# EAGLE design control (EAGLE 6.6.0)
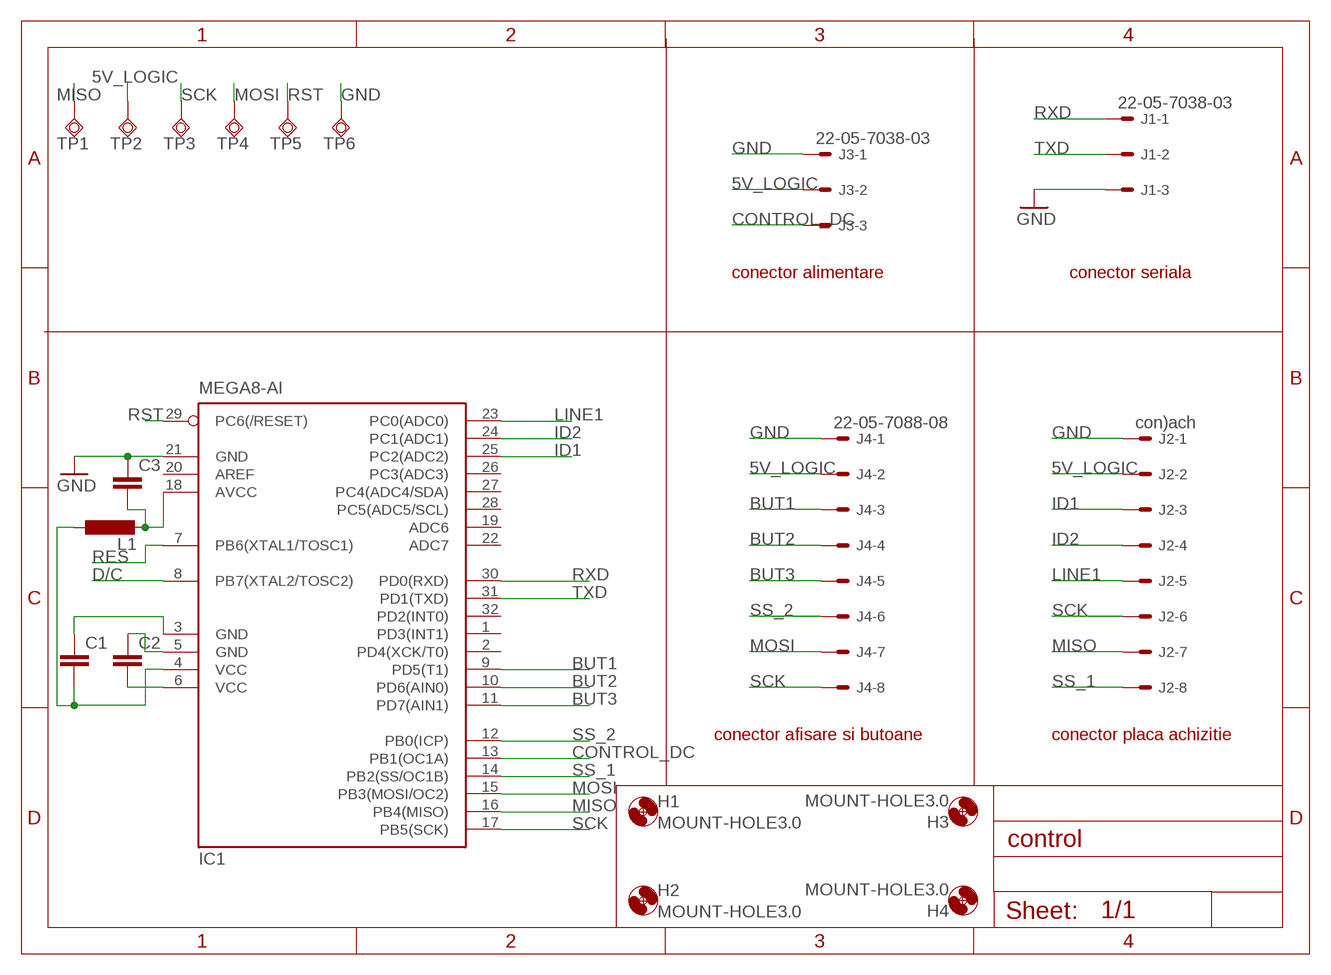
[diagram p0: schematic, sheet 1]

## Parts
C1  C-EUC0805K  [C0805K]
C2  C-EUC0805K  [C0805K]
C3  C-EUC0805K  [C0805K]
H1  MOUNT-HOLE3.0  [3,0]
H2  MOUNT-HOLE3.0  [3,0]
H3  MOUNT-HOLE3.0  [3,0]
H4  MOUNT-HOLE3.0  [3,0]
IC1  MEGA8-AI  [TQFP32-08]
J1  22-05-7038-03  [7395-03]
J2  con)ach  22-05-7088-08  [7395-08]
J3  22-05-7038-03  [7395-03]
J4  22-05-7088-08  [7395-08]
L1  L-EU0204/7  [0204/7]
TP1  TPSQPAD1-13  [P1-13]
TP2  TPSQPAD1-13  [P1-13]
TP3  TPSQPAD1-13  [P1-13]
TP4  TPSQPAD1-13  [P1-13]
TP5  TPSQPAD1-13  [P1-13]
TP6  TPSQPAD1-13  [P1-13]

## Nets
5V_LOGIC: C1.2 C2.2 IC1.4(VCC) IC1.6(VCC) J2.2 J3.2 J4.2 L1.1 TP2.TP
BUT1: IC1.9(PD5(T1)) J4.3
BUT2: IC1.10(PD6(AIN0)) J4.4
BUT3: IC1.11(PD7(AIN1)) J4.5
CONTROL_DC: IC1.13(PB1(OC1A)) J3.3
D/C: IC1.8(PB7(XTAL2/TOSC2))
GND: C1.1 C2.1 C3.1 IC1.3(GND) IC1.5(GND) IC1.21(GND) J1.3 J2.1 J3.1 J4.1 TP6.TP
ID1: IC1.25(PC2(ADC2)) J2.3
ID2: IC1.24(PC1(ADC1)) J2.4
LINE1: IC1.23(PC0(ADC0)) J2.5
MISO: IC1.16(PB4(MISO)) J2.7 TP1.TP
MOSI: IC1.15(PB3(MOSI/OC2)) J4.7 TP4.TP
N$1: C3.2 IC1.18(AVCC) L1.2
RES: IC1.7(PB6(XTAL1/TOSC1))
RST: IC1.29(PC6(/RESET)) TP5.TP
RXD: IC1.30(PD0(RXD)) J1.1
SCK: IC1.17(PB5(SCK)) J2.6 J4.8 TP3.TP
SS_1: IC1.14(PB2(SS/OC1B)) J2.8
SS_2: IC1.12(PB0(ICP)) J4.6
TXD: IC1.31(PD1(TXD)) J1.2
Unconnected: IC1.1(PD3(INT1)) IC1.2(PD4(XCK/T0)) IC1.19(ADC6) IC1.20(AREF) IC1.22(ADC7) IC1.26(PC3(ADC3)) IC1.27(PC4(ADC4/SDA)) IC1.28(PC5(ADC5/SCL)) IC1.32(PD2(INT0))

## Notes on the sheet
- conector alimentare | conector seriala
- conector afisare si butoane | conector placa achizitie

## Library data of the parts
C1-C3 = resistor:C-EU: CAPACITOR, European symbol
H1-H4 = holes:MOUNT-HOLE: MOUNTING HOLE with drill center marker
IC1 = atmel:MEGA8: MICROCONTROLLER 8 Kbytes FLASH, 1 kbytes SRAM, 512 bytes EEPROM, USART, 6-channel 10 bit ADC, 2-channel 8 bit ADC Pin compatible with Atmega48, ATMega88, ATMega168 Source: avr.lbr; MPN: ATMEGA8-16AU; OC_FARNELL: 9171371; OC_NEWARK: 73M8863
J1 J3 = con-molex:22-?-03: CONNECTOR wire to board 2.54 mm (.1 inch) pitch header; OC_FARNELL: unknown; OC_NEWARK: unknown
J2 J4 = con-molex:22-?-08: CONNECTOR wire to board 2.54 mm (.1 inch) pitch header; OC_FARNELL: unknown; OC_NEWARK: unknown
L1 = resistor:L-EU: INDUCTOR, European symbol
TP1-TP6 = testpad:TPSQ: Test pad

## Board
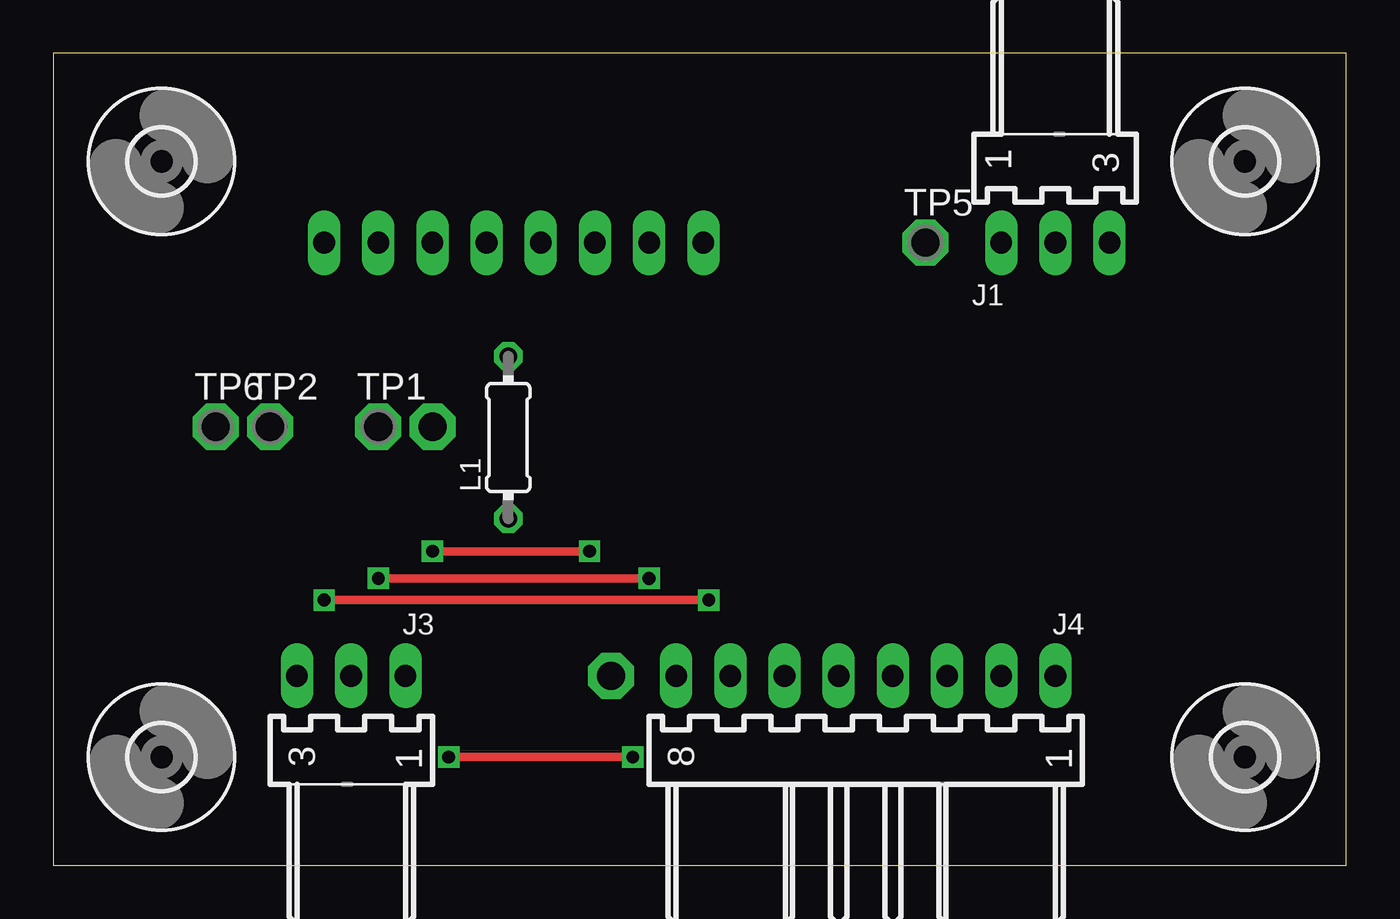
[diagram p1: board, top side]
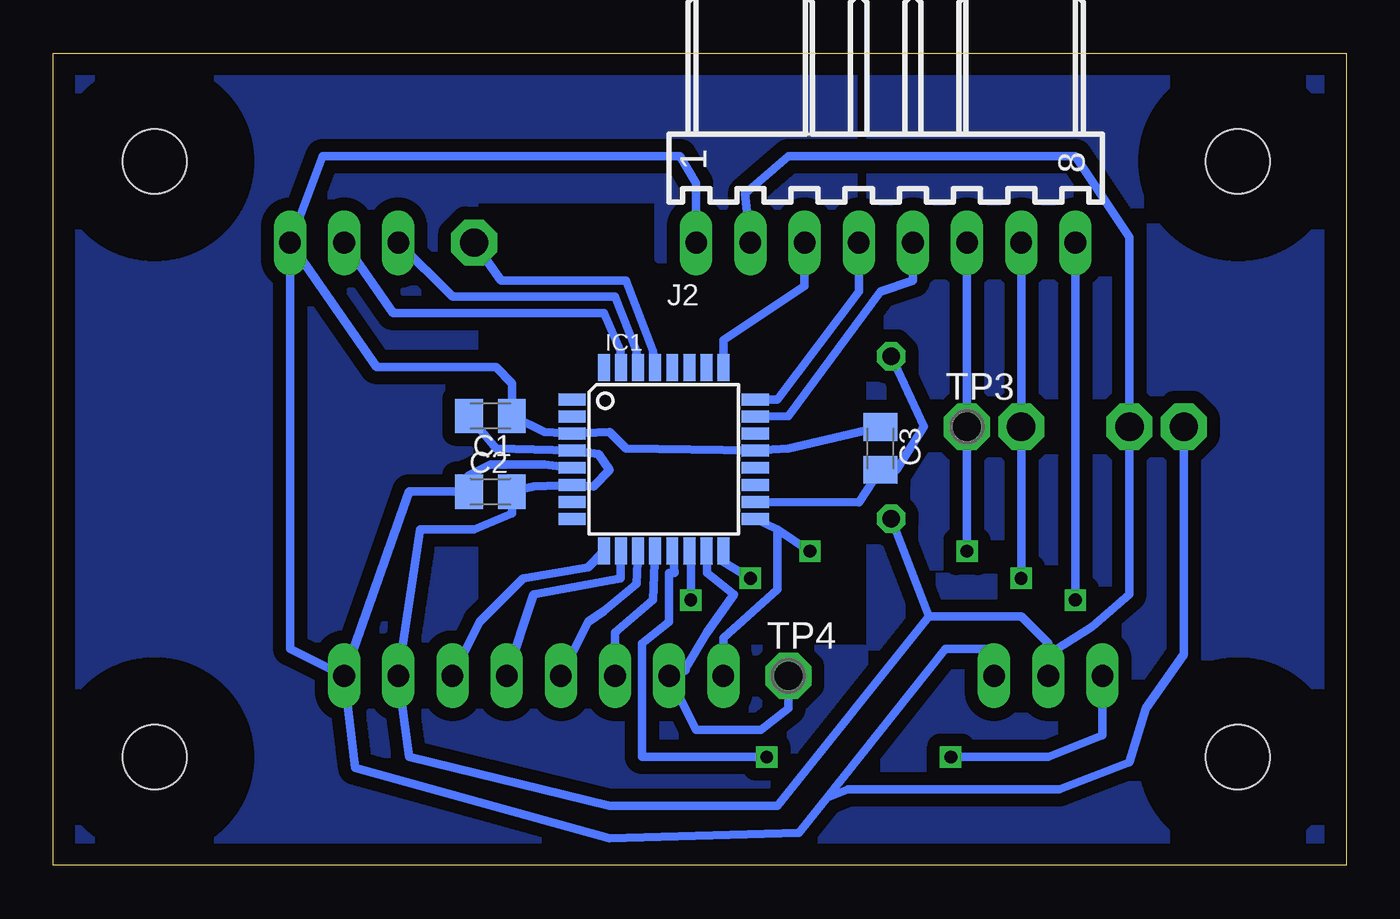
[diagram p2: board, bottom side, seen from below]

Size 60.63 x 38.09 mm. Coordinates in mm from the lower left corner, seen from the top.
Outline: 0,0 60.63,0 60.63,38.09 0,38.09 0,0
Copper layers (1*16): Top 0.035mm / dielectric 1.5mm / Bottom 0.035mm
Design rules "default": minimum track width 10mil, minimum drill 24mil, track to track 8mil, track to pad 8mil, pad to pad 8mil, via to via 8mil, smd to smd 8mil, copper to edge 40mil, drill to drill 8mil, minimum pad ring 10mil, minimum via ring 8mil, stop-mask expansion 4mil, vias tented up to drill 0mil, thermal gap 10mil

### Footprints (pad centres in the part's own frame; a part is rotated, then mirrored left to right if it is on the bottom)
C0805K = smd 1.3 x 1.6: 1 -1,0; 2 1,0
3,0 = hole 3: 0,0
TQFP32-08 = smd 1.27 x 0.559: 1 -4.293,2.8; 2 -4.293,2; 3 -4.293,1.2; 4 -4.293,0.4; 5 -4.293,-0.4; 6 -4.293,-1.2; 7 -4.293,-2; 8 -4.293,-2.8; 17 4.293,-2.8; 18 4.293,-2; 19 4.293,-1.2; 20 4.293,-0.4; 21 4.293,0.4; 22 4.293,1.2; 23 4.293,2; 24 4.293,2.8 | smd 0.559 x 1.27: 9 -2.8,-4.293; 10 -2,-4.293; 11 -1.2,-4.293; 12 -0.4,-4.293; 13 0.4,-4.293; 14 1.2,-4.293; 15 2,-4.293; 16 2.8,-4.293; 25 2.8,4.293; 26 2,4.293; 27 1.2,4.293; 28 0.4,4.293; 29 -0.4,4.293; 30 -1.2,4.293; 31 -2,4.293; 32 -2.8,4.293
7395-03 = drill 1.016 long: 1 2.54,0; 2 0,0; 3 -2.54,0
7395-08 = drill 1.016 long: 1 8.89,0; 2 6.35,0; 3 3.81,0; 4 1.27,0; 5 -1.27,0; 6 -3.81,0; 7 -6.35,0; 8 -8.89,0
0204/7 = drill 0.813 octagon: 1 -3.81,0; 2 3.81,0
P1-13 = drill 1.321 pad 2.159 octagon: TP 0,0

### Placement (x,y rotation side)
C1  40.13,21.08 180 bottom
C2  40.13,17.53 0 bottom
C3  21.84,19.56 270 bottom
H1  55.88,5.08 0 top
H2  55.88,33.02 0 top
H3  5.08,5.08 0 top
H4  5.08,33.02 0 top
IC1  32,19.05 0 bottom
J1  46.99,29.21 180 top
J2  21.59,29.21 180 bottom
J3  13.97,8.89 0 top
J4  38.1,8.89 0 top
L1  21.34,20.07 90 top
TP1  15.24,20.57 0 top
TP2  10.16,20.57 0 top
TP3  17.78,20.57 0 bottom
TP4  26.16,8.89 0 bottom
TP5  40.89,29.21 0 top
TP6  7.62,20.57 0 top

### Tracks (layer width: path | path; a pad name or v marks a point on that pad's centre or on a via)
5V_LOGIC
  Bottom 0.406: C1.2 39.88,19.56 IC1.4 35.05,19.3 34.54,18.54 35.31,17.78 IC1.6 38.1,17.78 C2.2 39.12,16.51 40.89,15.75 43.43,15.75 J4.2 43.94,5.08 34.54,2.79 26.67,2.79 19.56,11.68 | J3.2 13.97,9.91 | 13.97,9.91 13.97,10.41 15.24,11.68 19.56,11.68 | 19.56,11.68 L1.1 | J2.2 28.19,31.5 26.16,33.27 12.7,33.27 10.16,29.46 TP2.TP 10.16,20.32 10.16,12.7 11.94,11.18 13.97,9.91
BUT1
  Bottom 0.406: IC1.9 35.56,13.97 38.61,13.46 40.64,11.43 J4.3
BUT2
  Bottom 0.406: IC1.10 34.04,13.46 38.1,12.7 J4.4
BUT3
  Bottom 0.406: IC1.11 33.27,13.21 34.8,11.94 35.56,11.43 J4.5
CONTROL_DC  (via drill 0.6)
  Top 0.406: v27.18,5.08 v18.54,5.08
  Bottom 0.406: J3.3 11.43,6.1 13.97,5.08 v18.54,5.08 | IC1.13 31.5,13.72 31.75,13.72 31.75,11.43 33.02,10.41 33.02,5.08 v27.18,5.08
GND
  Bottom 0.406: 37.59,20.32 IC1.3 34.54,20.32 33.78,19.56 IC1.21 26.16,19.56 C3.1 | 37.59,20.32 C1.1 | IC1.5 37.59,18.8 40.13,18.8 41.15,18.29 C2.1 43.94,17.53 J4.1 | J1.3 49.53,10.16 J4.1 | 37.59,20.32 39.12,21.08 39.12,22.61 39.88,23.37 45.47,23.37 J1.3 | J3.1 16.51,10.16 18.8,10.16 24.35,3.17 | 24.35,3.17 25.65,1.52 34.54,1.27 46.48,4.57 J4.1 | J2.1 30.48,32 31.24,33.27 48.01,33.27 J1.3 | TP6.TP 7.62,9.91 9.4,7.37 10.16,4.83 13.46,3.56 23.37,3.56 24.35,3.17
ID1
  Bottom 0.406: IC1.25 29.21,24.64 25.4,27.18 J2.3
ID2
  Bottom 0.406: IC1.24 26.67,21.84 22.86,26.92 J2.4
LINE1
  Bottom 0.406: IC1.23 26.16,21.08 21.84,26.92 20.32,27.43 J2.5
MISO  (via drill 0.6)
  Top 0.406: v27.94,13.46 v15.24,13.46
  Bottom 0.406: J2.7 TP1.TP 15.24,20.32 v15.24,13.46 | IC1.16 29.21,14.22 v27.94,13.46
MOSI
  Bottom 0.406: 30.99,9.14 31.06,9.12 | 31.06,9.12 J4.7 30.48,6.35 27.43,6.35 26.16,7.37 TP4.TP | IC1.15 29.97,13.72 28.7,12.7 29.97,10.92 31.06,9.12
N$1
  Bottom 0.406: L1.2 19.81,20.57 21.08,18.54 C3.2 22.86,17.02 IC1.18
N$2
  pour Bottom (isolate 0.61): 0,38.35 22.1,38.35 22.1,0.51 22.1,-0.25 0,-0.25
N$3
  pour Bottom (isolate 0.61): 23.11,38.1 23.11,28.45 32.26,28.45 32.26,30.48 32.26,31.24 40.89,31.24 40.89,10.16 22.61,10.16 22.61,0 60.71,0 60.71,38.1
RST
  Bottom 0.406: IC1.29 32.51,24.13 33.78,27.43 39.62,27.43 TP5.TP
RXD
  Bottom 0.406: J1.1 41.91,26.67 34.29,26.67 33.27,24.13 IC1.30
SCK  (via drill 0.6)
  Top 0.406: v25.15,14.73 v17.78,14.73
  Bottom 0.406: IC1.17 26.67,15.75 | 26.67,15.75 26.67,12.95 29.21,10.67 J4.8 | J2.6 TP3.TP v17.78,14.73 | 26.67,15.75 v25.15,14.73
SS_1  (via drill 0.6)
  Top 0.406: v30.73,12.45 v12.7,12.45
  Bottom 0.406: J2.8 v12.7,12.45 | IC1.14 30.73,13.97 v30.73,12.45
SS_2
  Bottom 0.406: IC1.12 32.51,12.45 34.29,10.92 J4.6
TXD
  Bottom 0.406: 46.99,27.94 J1.2 44.7,25.91 34.8,25.91 34.04,24.13 34.04,23.34 IC1.31